# Altium schematic sheet ELRS.SchDoc
size C; SheetNumber: 6; SheetTotal: 6
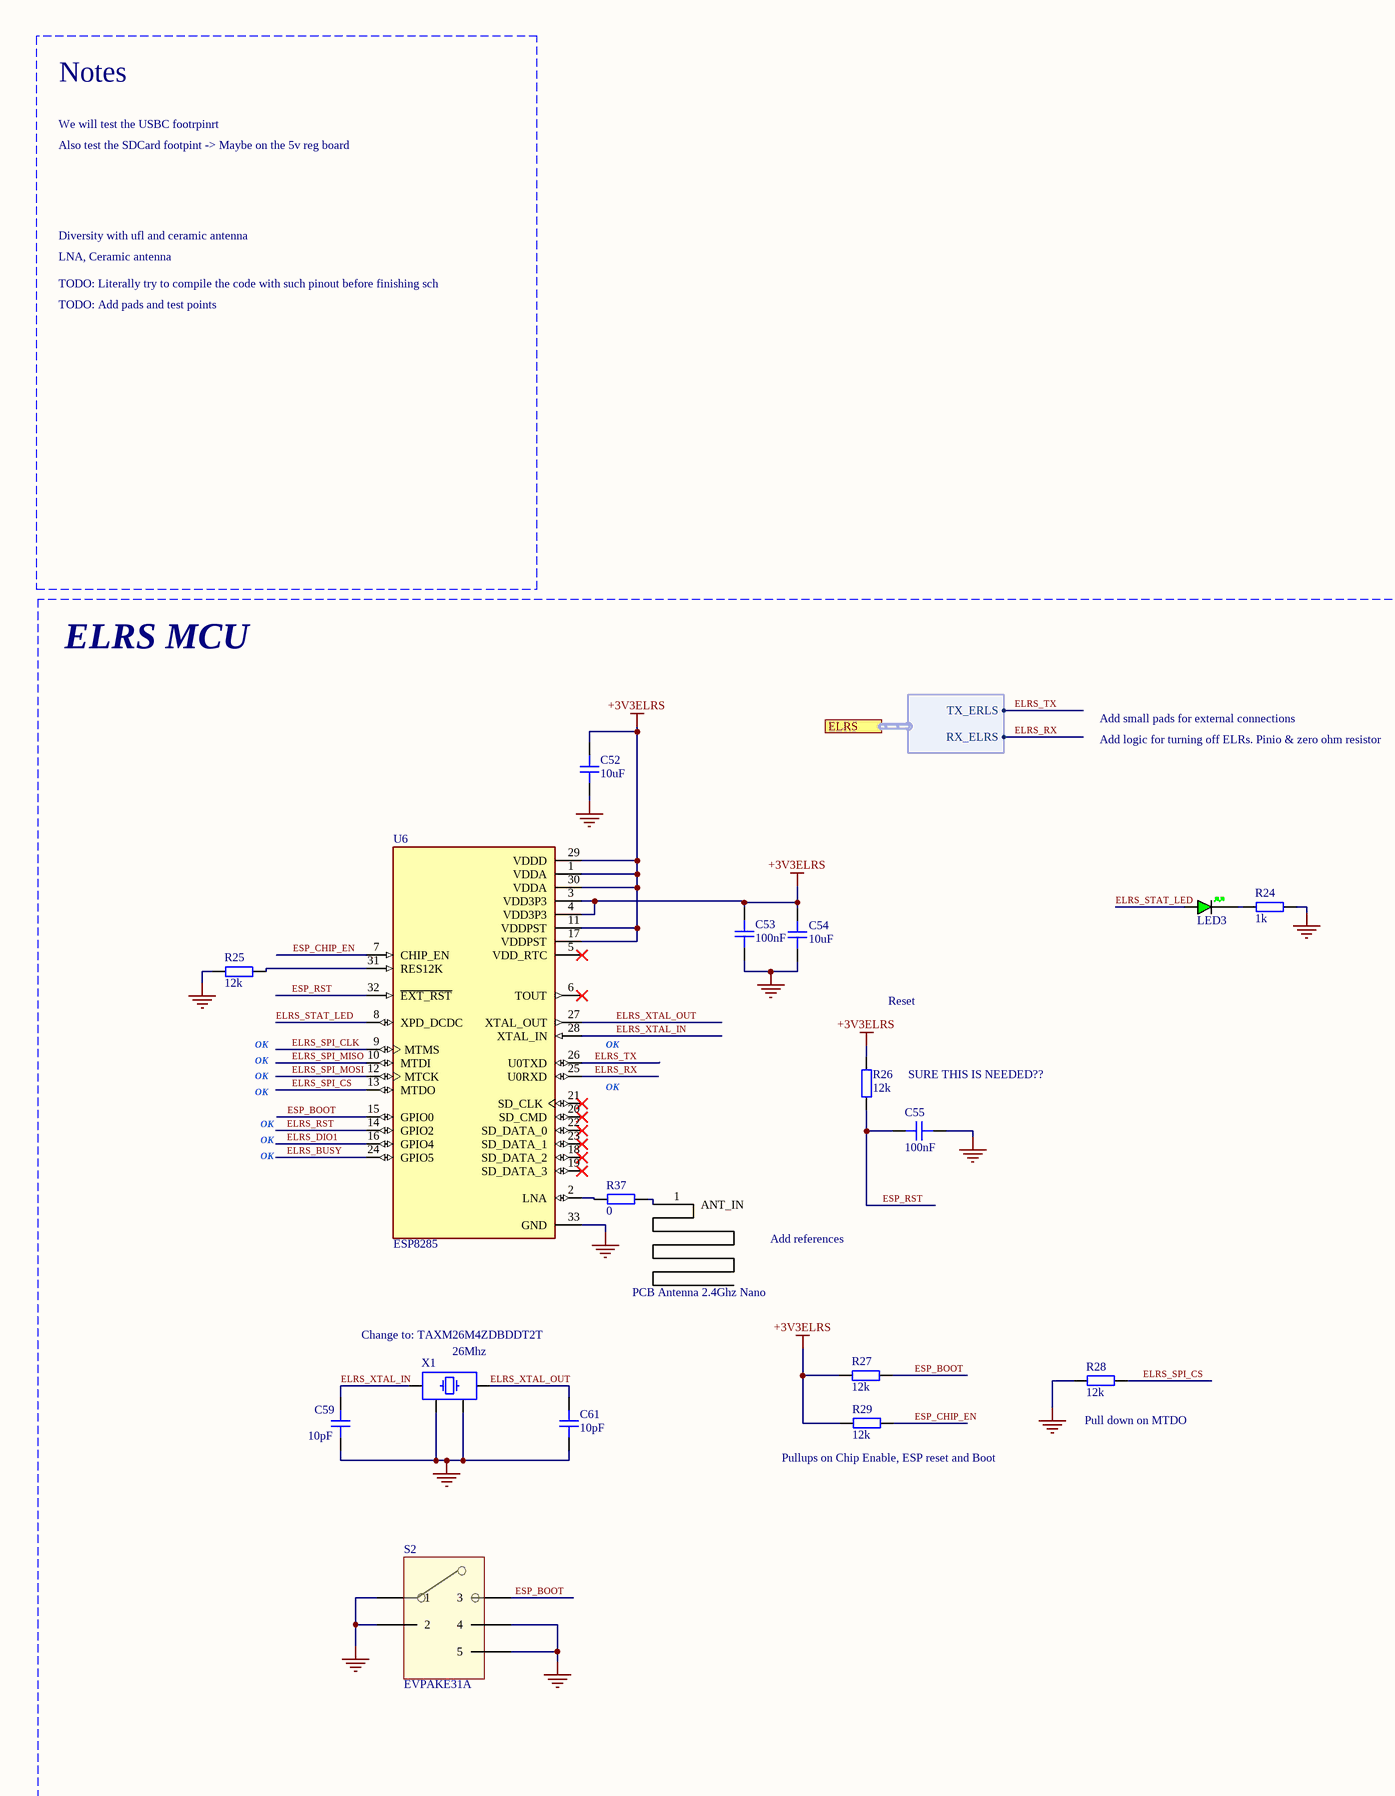
[diagram p0: ELRS.SchDoc, left]
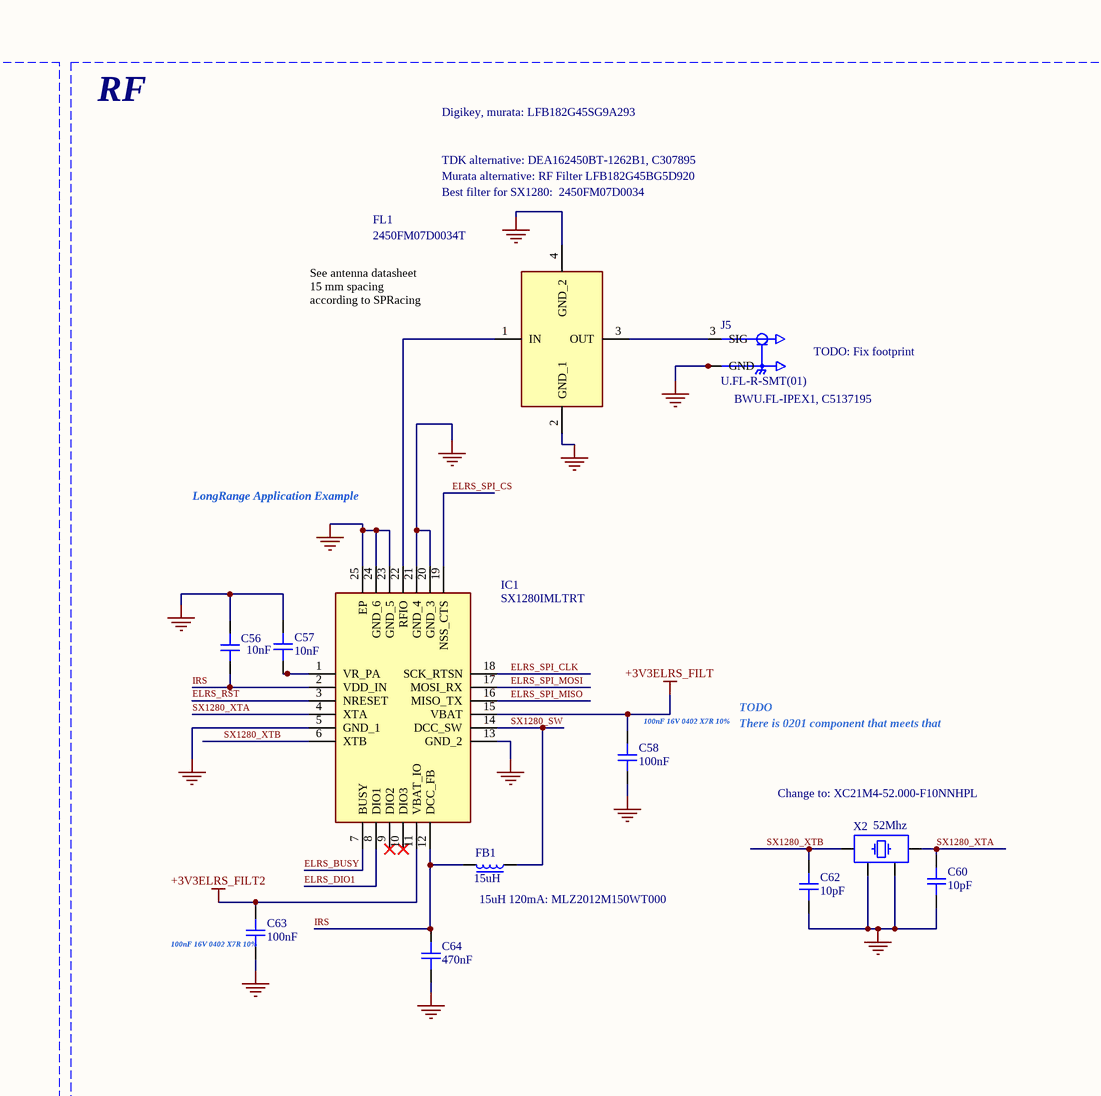
[diagram p1: ELRS.SchDoc, right]

## Parts
C52  10uF  [CAP_0402]
C53  100nF  [CAP_0201]
C54  10uF  [CAP_0402]
C55  100nF  [CAP_0201]
C56  10nF  [CAP_0201]
C57  10nF  [CAP_0201]
C58  100nF  [CAP_0201]
C59  10pF  [CAP_0201]
C60  10pF  [CAP_0201]
C61  10pF  [CAP_0201]
C62  10pF  [CAP_0201]
C63  100nF  [CAP_0201]
C64  470nF  [CAP_0402]
FB1  15uH  [FB_0805]
FL1  2450FM07D0034T  [2450FM07D0034T]
IC1  SX1280IMLTRT  [QFN50P400X400X100-25N-D]
J5  U.FL-R-SMT(01)  [HRS_U.FL-R-SMT(01)]
LED3  GREEN  [LED_0402_GREEN]  (value not drawn)
PCNANT1  PCB Antenna 2.4Ghz Nano  [PCB Antena Micro 2.4Ghz]
R24  1k  [RES_0201]
R25  12k  [RES_0201]
R26  12k  [RES_0201]
R27  12k  [RES_0201]
R28  12k  [RES_0201]
R29  12k  [RES_0201]
R37  0  [RES_0402]
S2  EVPAKE31A  [EVPAKE31A]
U6  ESP8285  [QFN50P500X500X90-33N]
X1  26Mhz  [XTAL_2016]
X2  52Mhz  [XTAL_2016]

## Blocks framed on the sheet
ELRS MCU: C52-C55 C59 C61 LED3 PCNANT1 R24-R29 R37 S2 U6 X1
RF: C56-C58 C60 C62-C64 FB1 FL1 IC1 J5 X2

## Ports
ELRS (harness ELRS, see Overview[3B], MCU[1C])

## Harnesses
ELRS: RX_ELRS, TX_ERLS

## Nets
+3V3ELRS: C52.2 C53.2 C54.2 R26.2 R27.1 R29.1 U6.1(VDDA) U6.3(VDD3P3) U6.4(VDD3P3) U6.11(VDDPST) U6.17(VDDPST) U6.29(VDDD) U6.30(VDDA)
+3V3ELRS_FILT: C58.2 IC1.15(VBAT)
+3V3ELRS_FILT2: C63.2 IC1.11(VBAT_IO)
GND: C52.1 C53.1 C54.1 C55.1 C56.2 C57.2 C58.1 C59.1 C60.1 C61.1 C62.1 C63.1 C64.2 FL1.2(GND_1) FL1.4(GND_2) IC1.5(GND_1) IC1.13(GND_2) IC1.20(GND_3) IC1.21(GND_4) IC1.23(GND_5) IC1.24(GND_6) IC1.25(EP) J5.1(GND) J5.2(GND) R24.2 R25.1 R28.1 S2.1 S2.2 S2.4 S2.5 U6.33(GND) X1.2 X1.4 X2.2 X2.4
ELRS_BUSY: IC1.7(BUSY) U6.24(GPIO5)
ELRS_DIO1: IC1.8(DIO1) U6.16(GPIO4)
ELRS_RST: IC1.3(NRESET) U6.14(GPIO2)
ELRS_RX: U6.25(U0RXD) ; port ELRS.RX_ELRS
ELRS_SPI_CLK: IC1.18(SCK_RTSN) U6.9(MTMS)
ELRS_SPI_CS: IC1.19(NSS_CTS) R28.2 U6.13(MTDO)
ELRS_SPI_MISO: IC1.16(MISO_TX) U6.10(MTDI)
ELRS_SPI_MOSI: IC1.17(MOSI_RX) U6.12(MTCK)
ELRS_STAT_LED: LED3.A U6.8(XPD_DCDC)
ELRS_TX: U6.26(U0TXD) ; port ELRS.TX_ERLS
ELRS_XTAL_IN: C59.2 U6.28(XTAL_IN) X1.1
ELRS_XTAL_OUT: C61.2 U6.27(XTAL_OUT) X1.3
ESP_BOOT: R27.2 S2.3 U6.15(GPIO0)
ESP_CHIP_EN: R29.2 U6.7(CHIP_EN)
ESP_RST: C55.2 R26.1 U6.32(~{EXT_RST})
IRS: C56.1 C64.1 FB1.2 IC1.2(VDD_IN) IC1.12(DCC_FB)
SX1280_SW: FB1.1 IC1.14(DCC_SW)
SX1280_XTA: C60.2 IC1.4(XTA) X2.3
SX1280_XTB: C62.2 IC1.6(XTB) X2.1
NetC57_1: C57.1 IC1.1(VR_PA)
NetFL1_1: FL1.1(IN) IC1.22(RFIO)
NetFL1_3: FL1.3(OUT) J5.3(SIG)
NetLED3_K: LED3.K R24.1
NetPCNANT1_1: PCNANT1.1(ANT_IN) R37.2
NetR25_2: R25.2 U6.31(RES12K)
NetR37_1: R37.1 U6.2(LNA)

Not connected (* = marked no-connect by the designer): IC1 9(DIO2)* 10(DIO3)*; U6 5(VDD_RTC)* 6(TOUT)* 18(SD_DATA_2)* 19(SD_DATA_3)* 20(SD_CMD)* 21(SD_CLK)* 22(SD_DATA_0)* 23(SD_DATA_1)*

## Notes on the sheet
- We will test the USBC footrpinrt
- Notes
- Also test the SDCard footpint -> Maybe on the 5v reg board
- LNA, Ceramic antenna
- Diversity with ufl and ceramic antenna
- TODO: Literally try to compile the code with such pinout before finishing sch
- TODO: Add pads and test points
- Digikey, murata: LFB182G45SG9A293
- Add small pads for external connections
- Add logic for turning off ELRs. Pinio & zero ohm resistor
- Murata alternative: RF Filter LFB182G45BG5D920
- Best filter for SX1280:  2450FM07D0034
- TDK alternative: DEA162450BT-1262B1, C307895
- See antenna datasheet 15 mm spacing according to SPRacing
- (near J5) BWU.FL-IPEX1, C5137195
- TODO: Fix footprint
- Reset
- OK
- (near U6) OK
- SURE THIS IS NEEDED??
- LongRange Application Example
- Add references
- (near C58) 100nF 16V 0402 X7R 10%
- There is 0201 component that meets that
- TODO
- (near X1) Change to: TAXM26M4ZDBDDT2T
- Change to: XC21M4-52.000-F10NNHPL
- (near R29) Pullups on Chip Enable, ESP reset and Boot
- (near R28) Pull down on MTDO
- (near C63) 100nF 16V 0402 X7R 10%
- (near FB1) 15uH 120mA: MLZ2012M150WT000

## Library data of the parts
C52 C54 C64 = CAP_0402: Capacitor SMD 0402; Manufacturer: *; Manufacturer Part Number: *; Distributor Link: *; LCSC: *; Rating: *; Dielectric: *
C53 C55-C63 = CAP_0201: Capacitor SMD 0201; Manufacturer: *; Manufacturer Part Number: *; Distributor Link: *; LCSC: *; Rating: *; Dielectric: *
FB1 = FB_0805: Ferrite Bead SMD 0805; Manufacturer: *; Manufacturer Part Number: *; Distributor Link: *; LCSC: *
FL1 = 2450FM07D0034T: Filter; Manufacturer_Name: JOHANSON TECHNOLOGY; Datasheet Link: https://www.mouser.co.uk/datasheet/2/611/2450FM07D0034-1375634.pdf; Height: 0.4mm; Manufacturer_Part_Number: 2450FM07D0034T; Mouser Part Number: 609-2450FM07D0034T; Mouser Price/Stock: https://www.mouser.co.uk/ProductDetail/Johanson-Technology/2450FM07D0034T?qs=%252BEew9%252B0nqrBEY7VUloPs4Q%3D%3D; Arrow Part Number: 2450FM07D0034T; Arrow Price/Stock: https://www.arrow.com/en/products/2450fm07d0034t/johanson-dielectrics?region=nac
IC1 = SX1280IMLTRT: Integrated Circuit; Manufacturer_Name: SEMTECH; Datasheet Link: https://datasheet.datasheetarchive.com/originals/distributors/DKDS-37/728740.pdf; Height: 1mm; Manufacturer_Part_Number: SX1280IMLTRT; Mouser Part Number: 947-SX1280IMLTRT; Mouser Price/Stock: https://www.mouser.co.uk/ProductDetail/Semtech/SX1280IMLTRT?qs=5aG0NVq1C4xuoq8G6ZzdxQ%3D%3D; Arrow Part Number: SX1280IMLTRT; Arrow Price/Stock: https://www.arrow.com/en/products/sx1280imltrt/semtech?region=nac
J5 = U.FL-R-SMT(01): U.FL (UMCC) Connector Receptacle, Male Pin 50Ohm Surface Mount Solder. RF Connectors / Coaxial Connectors; MF: Hirose; Check_prices: https://www.snapeda.com/parts/U.FL-R-SMT(01)/Hirose+Electric+Co+Ltd/view-part/?ref=eda; LCSC Part #: *; Availability: In Stock; MP: U.FL-R-SMT(01); Price: None; Package: None; SnapEDA_Link: https://www.snapeda.com/parts/U.FL-R-SMT(01)/Hirose+Electric+Co+Ltd/view-part/?ref=snap; Purchase-URL: https://pricing.snapeda.com/search/part/U.FL-R-SMT(01)/?ref=eda
LED3 = LED_0402_GREEN: LED 0402 GREEN SMD
R24-R29 = RES_0201: Resistor SMD 0201; Manufacturer: *; Manufacturer Part Number: *; Distributor Link: *; LCSC: *
R37 = RES_0402: Resistor SMD 0402; Manufacturer: *; Manufacturer Part Number: *; Distributor Link: *; LCSC: *
U6 = ESP8285: IC RF TxRx + MCU WiFi 802.11b/g/n 2.4GHz 32-VFQFN Exposed Pad; MF: Espressif Systems; SnapEDA_Link: https://www.snapeda.com/parts/ESP8285/Espressif%20Systems/view-part/2603302/?ref=snap; Price: None; MP: ESP8285; Package: VFQFN-32 Espressif Systems; Value: *; Availability: Unavailable
X1 X2 = XTAL_2016: Crystal SMD 4-Pin 2.0x1.6mm; Distributor Link: *